# Altium schematic sheet SAML21_Xplained_Pro_SAML21_peripherals.SchDoc: Target MCU peripherals
size A3; Organization: ATMEL Norway; Address1: Vestre Rosten 79; Address2: N-7075 TILLER; Address3: NORWAY; DocumentNumber: A09-2241; Revision: 4; SheetNumber: 3; SheetTotal: 10; PageSetup: Record=PageOptions|CenterHorizontal=True|CenterVertical=True|PrintScale=1.01|XCorrection=1.00|YCorrection=1.00|PrintKind=1|BorderSize=5000000|LeftOffset=0|BottomOffset=0|Orientation=2|PaperLength=1000|PaperWidth=1000|Scale=100|PaperSource=7|PrintQuality=-4|MediaType=1|DitherType=10|PaperKind=A3 (297 x 420 mm)|PrintScaleMode=1
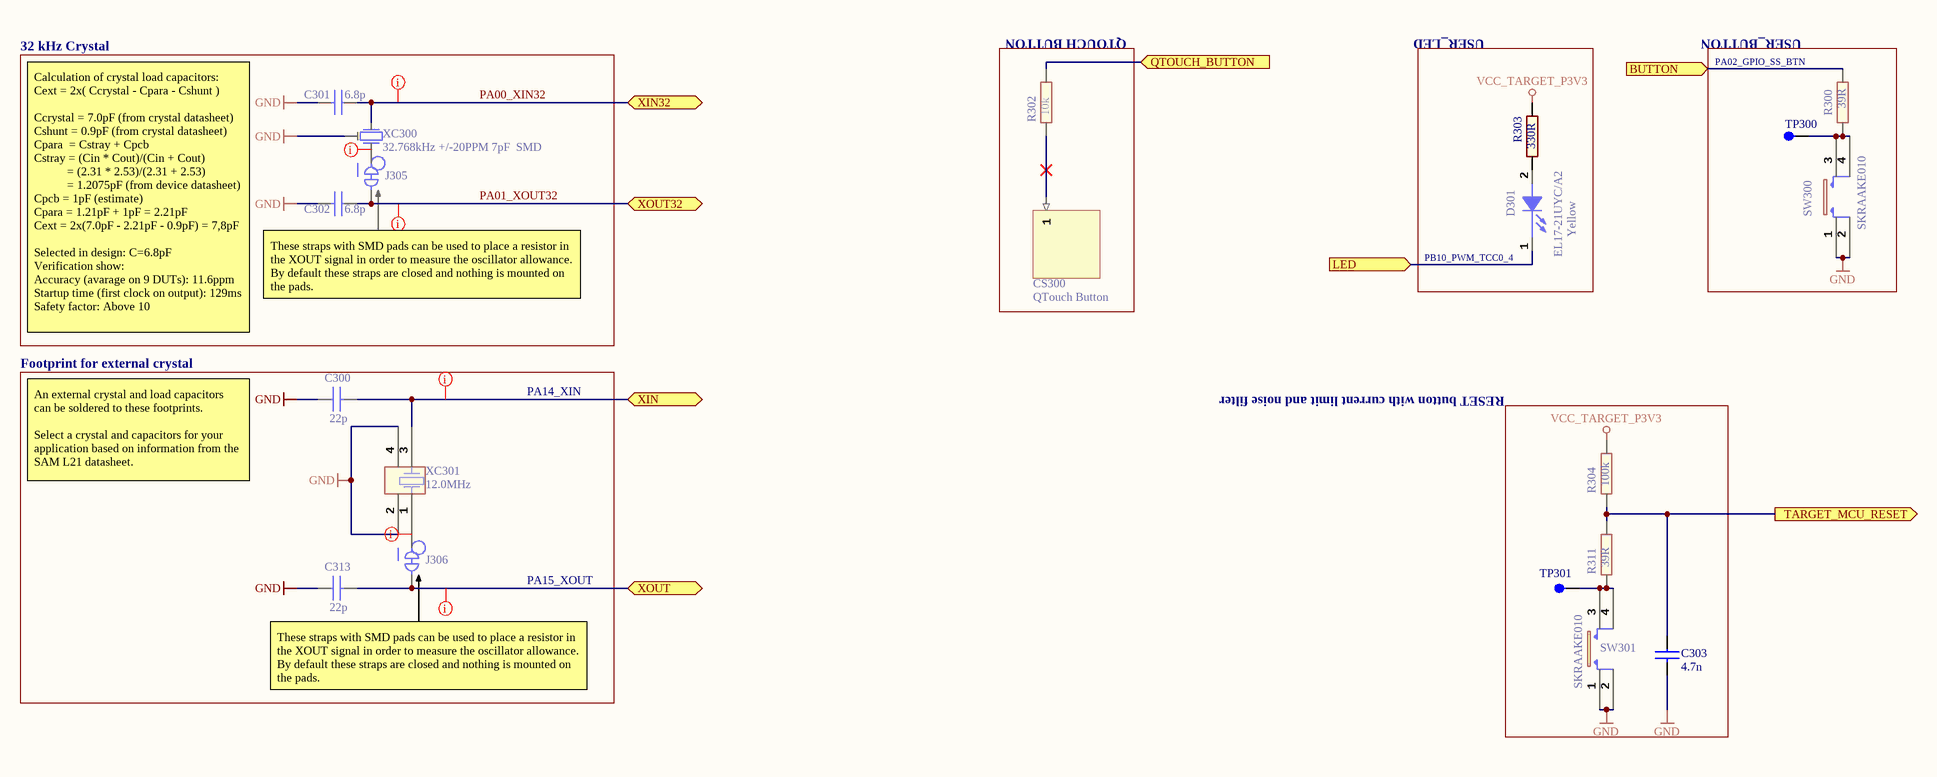
[diagram p0: SAML21_Xplained_Pro_SAML21_peripherals.SchDoc]

## Parts
C300  value 22p  [AP1-00001]  (hidden comment: CAP-NONPOL)
C301  value 6.8p  [AP1-00053]  (hidden comment: CAP-NONPOL)
C302  value 6.8p  [AP1-00053]  (hidden comment: CAP-NONPOL)
C303  value 4.7n  [AP1-00053]  (hidden comment: CAP-NONPOL)
C313  value 22p  [AP1-00001]  (hidden comment: CAP-NONPOL)
CS300  QTouch Button  (no BOM)
D301  Yellow  value EL17-21UYC/A2  [AP4-00013]
J305  (no value)  [AP9-00044]  (net tie, no BOM)
J306  (no value)  [AP9-00044]  (net tie, no BOM)
R300  value 39R  [AP2-00011]  (hidden comment: R2)
R302  value 10k  [AP2-00011]  (hidden comment: R2)
R303  value 330R  [AP2-00011]  (hidden comment: R2)
R304  value 100k  [AP2-00011]  (hidden comment: R2)
R311  value 39R  [AP2-00011]  (hidden comment: R2)
SW300  value SKRAAKE010  [AP8-00137]  (hidden comment: Can be ordered in low volumes from Mouser)
SW301  value SKRAAKE010  [AP8-00137]  (hidden comment: Can be ordered in low volumes from Mouser)
TP300  TESTPOINT  [AP8-00010]  (value not drawn)  (no BOM)
TP301  TESTPOINT  [AP8-00010]  (value not drawn)  (no BOM)
XC300  value 32.768kHz +/-20PPM 7pF  SMD  [AP7-00044]  (hidden comment: Farnell order no:1539364)
XC301  value 12.0MHz  [AP7-00039]  (hidden comment: CRYSTAL1324)

## Blocks framed on the sheet
32 kHz Crystal: C301 C302 J305 XC300
QTOUCH BUTTON: CS300 R302
USER_LED: D301 R303
USER_BUTTON: R300 SW300 TP300
Footprint for external crystal: C300 C313 J306 XC301
RESET button with current limit and noise filter: C303 R304 R311 SW301 TP301

## Ports
BUTTON (in), LED (in), QTOUCH_BUTTON (in), TARGET_MCU_RESET (out), XIN32 (bidir), XIN (bidir), XOUT32 (bidir), XOUT (bidir)

## Nets
GND: C300.1 C301.2 C302.2 C303.2 C313.1 SW300.1 SW300.2 SW301.1 SW301.2 XC300.3 XC301.2 XC301.4
VCC_TARGET_P3V3: R303.2 R304.2
BUTTON: R300.2 ; port BUTTON
LED: D301.1(CATHODE) ; port LED
PA00_XIN32: C301.1 XC300.2 ; port XIN32
PA01_XOUT32: C302.1 J305.2 ; port XOUT32
QTOUCH_BUTTON: R302.2 ; port QTOUCH_BUTTON
TARGET_MCU_RESET: C303.1 R304.1 R311.2 ; port TARGET_MCU_RESET
XIN: C300.2 XC301.3 ; port XIN
XOUT: C313.2 J306.2 ; port XOUT
NetCS300_1: CS300.1 R302.1
NetD301_2: D301.2(ANODE) R303.1
NetJ305_1: J305.1 XC300.1
NetJ306_1: J306.1 XC301.1
NetR300_1: R300.1 SW300.3 SW300.4 TP300.1
NetR311_1: R311.1 SW301.3 SW301.4 TP301.1

## Layout directives
rule Assembly Testpoint Usage [Testpoint - Not Allowed    Multiple - Not Allowed]: NetJ305_1, NetJ306_1, PA00_XIN32, PA01_XOUT32, XIN, XOUT

## Notes on the sheet
- PA02_GPIO_SS_BTN
- (near D301) PB10_PWM_TCC0_4
- Calculation of crystal load capacitors:
  Cext = 2x( Ccrystal - Cpara - Cshunt )
  Ccrystal = 7.0pF (from crystal datasheet)
  Cshunt = 0.9pF (from crystal datasheet)
  Cpara  = Cstray + Cpcb
  Cstray = (Cin * Cout)/(Cin + Cout)
  = (2.31 * 2.53)/(2.31 + 2.53)
  = 1.2075pF (from device datasheet)
  Cpcb = 1pF (estimate)
  Cpara = 1.21pF + 1pF = 2.21pF
  Cext = 2x(7.0pF - 2.21pF - 0.9pF) = 7,8pF
  Selected in design: C=6.8pF
  Verification show:
  Accuracy (avarage on 9 DUTs): 11.6ppm
  Startup time (first clock on output): 129ms
  Safety factor: Above 10
- These straps with SMD pads can be used to place a resistor in the XOUT signal in order to measure the oscillator allowance.
  By default these straps are closed and nothing is mounted on the pads.
- PA14_XIN
- An external crystal and load capacitors can be soldered to these footprints.
  Select a crystal and capacitors for your application based on information from the SAM L21 datasheet.
- PA15_XOUT
- Date:
- PAGE:
- of
- TITLE:
- Document number:
- Revision:

## Library data of the parts
C300 C313 = A01-0019: Ceramic capacitor, SMD 0402, NP0, 50V, +/-5%; PartGroup: Capacitors,Ceramic,SMD 0402; TemperatureRange: -55 - +125 deg C; AN: A01-0019; Tolerance: 50V, +/-5%; Height: 0,550000011920929
C301 C302 = A01-0013: Ceramic capacitor, SMD 0402, NP0, 50V, +/-5%; PartGroup: Capacitors,Ceramic,SMD 0402; TemperatureRange: -55 - +125 deg C; AN: A01-0013; Tolerance: 50V, +/-5%; Height: 0,550000011920929
C303 = A01-0046: Ceramic capacitor, SMD 0402, X7R, 25V, +/-10% (de35287); PartGroup: Capacitors,Ceramic,SMD 0402; TemperatureRange: -55 - +125 deg C; AN: A01-0046; Tolerance: 25V, +/-10%; Height: 0.550000011920929
CS300 = QTouchButton: ConfiguratorName: ATMEL_TOUCH; ConfigurationParameters: {}__sensorid[1]{}width[8]{}height[8]{}
D301 = A10-0019: LED, Yellow, Wave length=591nm, SMD 0805, ±70°; PartGroup: Opto,LEDs,SMD; Manufacturer: Everlight; MPN: 17-21UYC/S530-A3/TR8; TemperatureRange: -40 to +85 deg C; AN: A10-0019; Height: 1,10000002384186
J305 J306 = A09-0783: Default closed SMD strap, 0603 size; PartGroup: Mechanical devices,PCB implemented components; Value: SMD-STRAP_0603_CLOSED; AN: A09-0783; Height: 0
R300 R311 = A02-0178: Thick film resistor, SMD 0402, 1/16W, 1%; PartGroup: Resistors,SMD,0402 1%; TemperatureRange: -55 - +125 deg C; AN: A02-0178; Tolerance: 1 %; Height: 0,349999994039536
R302 = A02-0236: Thick film resistor, SMD 0402, 1/16W, 1%; PartGroup: Resistors,SMD,0402 1%; Manufacturer: vishay; MPN: CRCW040210K0FKED; TemperatureRange: -55 - +125 deg C; AN: A02-0236; Tolerance: 1 %; Height: 0,349999994039536
R303 = A02-0200: Thick film resistor, SMD 0402, 1/16W, 1%; PartGroup: Resistors,SMD,0402 1%; TemperatureRange: -55 - +125 deg C; AN: A02-0200; Tolerance: 1 %; Height: 0.349999994039536
R304 = A02-0260: Thick film resistor, SMD 0402, 1/16W, 1%; PartGroup: Resistors,SMD,0402 1%; TemperatureRange: -55 - +125 deg C; AN: A02-0260; Tolerance: 1 %; Height: 0,349999994039536
SW300 SW301 = A08-0790: 6.2x6.2 mm SMD tact switch, same as A08-0091 but less force is needed; PartGroup: Mechanical devices,Switches,SMD; Manufacturer: ALPS; TemperatureRange: -30 - +90 deg C; AN: A08-0790; Height: 5,09999990463257; MPN: SKRAAKE010
TP300 TP301 = A08-0004: Single SMD testpad; PartGroup: Mechanical devices,Connectors,Test points; AN: A08-0004; Value: TESTPAD; Height: 0
XC300 = A07-0052: 32k768 crystal, +-20ppm, CL=7pF, max ESR 60kOhm, SMD; PartGroup: Frequency devices,Crystals,SMD; Manufacturer: Micro Crystal; MPN: MS1V-T1K 32.768kHz 7pF +/-20PPM TA; Tolerance: +/- 20 PPM; TemperatureRange: -40 /+85; AN: A07-0052; Height: 2.07999992370605
XC301 = A07-0042: Fox FQ5032B 12.0MHz SMD crystal 738B-12; PartGroup: Frequency devices,Crystals,SMD; Manufacturer: Fox  Electronics; MPN: FQ5032B-12-C-C-C-200-1 / 738B-12; Tolerance: 30PPM; AN: A07-0042; Height: 1.20000004768372